# Altium schematic sheet R7FA4M3AF3CFB.SchDoc
size A3; SheetNumber: 9; SheetTotal: 13
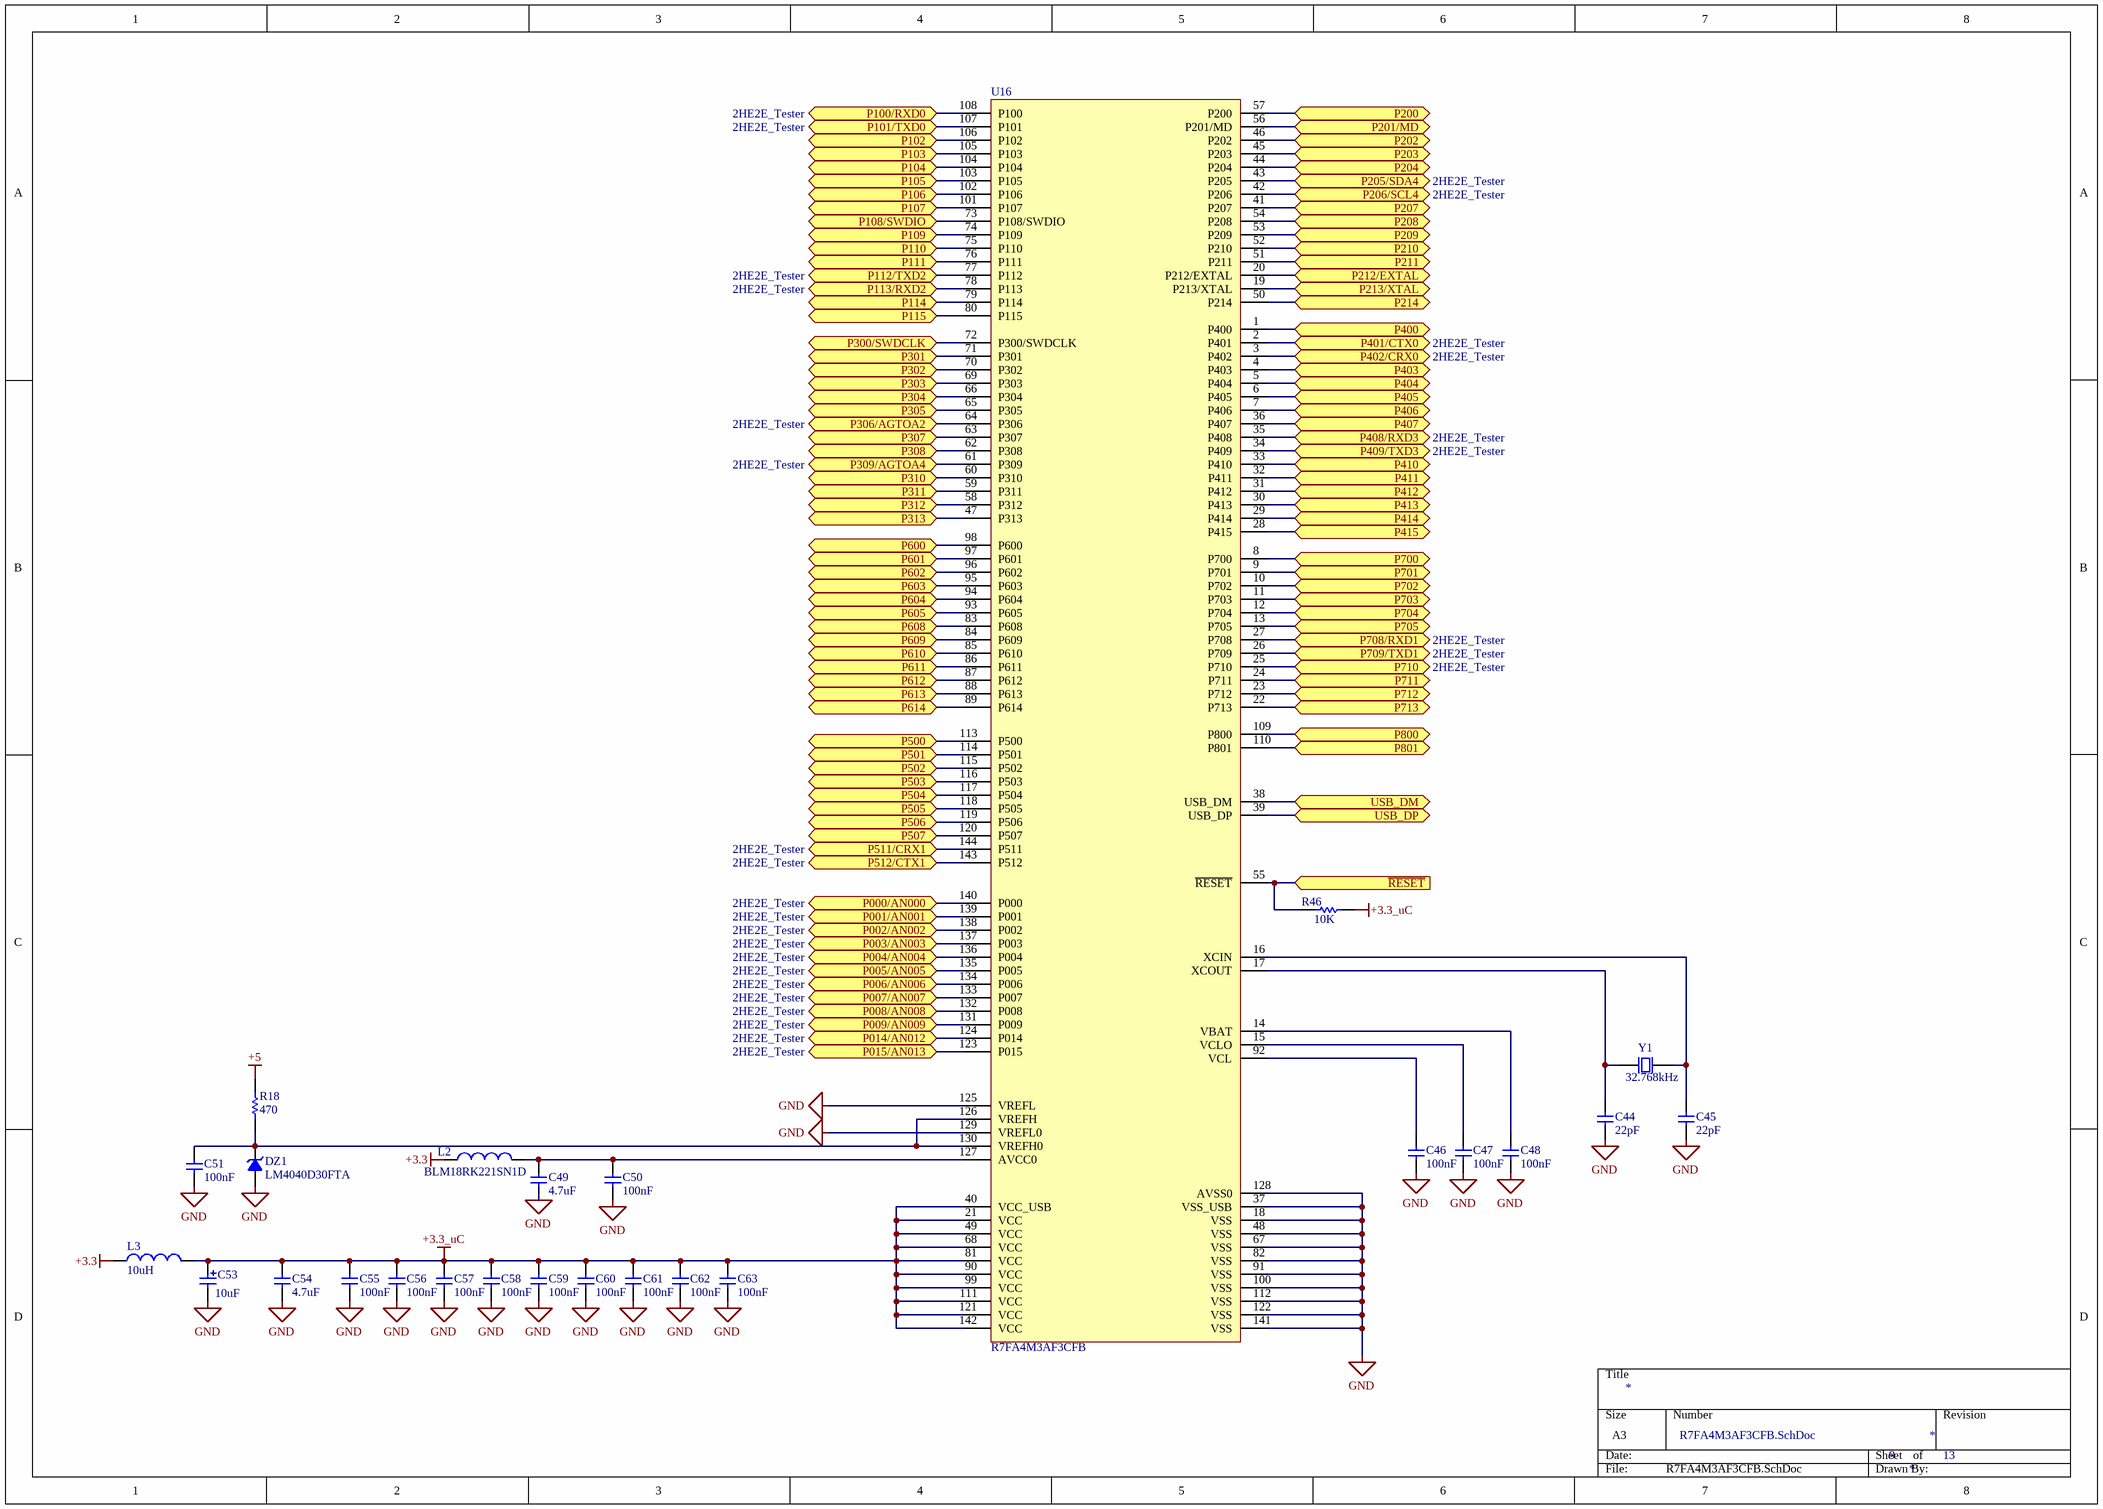
[diagram p0: R7FA4M3AF3CFB.SchDoc]

## Parts
C44  value 22pF  [0603M-C]  (hidden comment: Cap Ceramic)
C45  value 22pF  [0603M-C]  (hidden comment: Cap Ceramic)
C46  value 100nF  [0603M-C]  (hidden comment: Cap Ceramic)
C47  value 100nF  [0603M-C]  (hidden comment: Cap Ceramic)
C48  value 100nF  [0603M-C]  (hidden comment: Cap Ceramic)
C49  value 4.7uF  [0603M-C]  (hidden comment: Cap Ceramic)
C50  value 100nF  [0603M-C]  (hidden comment: Cap Ceramic)
C51  value 100nF  [0603M-C]  (hidden comment: Cap Ceramic)
C53  value 10uF  [Cap CASE A]  (hidden comment: Cap Tantalio)
C54  value 4.7uF  [0603M-C]  (hidden comment: Cap Ceramic)
C55  value 100nF  [0603M-C]  (hidden comment: Cap Ceramic)
C56  value 100nF  [0603M-C]  (hidden comment: Cap Ceramic)
C57  value 100nF  [0603M-C]  (hidden comment: Cap Ceramic)
C58  value 100nF  [0603M-C]  (hidden comment: Cap Ceramic)
C59  value 100nF  [0603M-C]  (hidden comment: Cap Ceramic)
C60  value 100nF  [0603M-C]  (hidden comment: Cap Ceramic)
C61  value 100nF  [0603M-C]  (hidden comment: Cap Ceramic)
C62  value 100nF  [0603M-C]  (hidden comment: Cap Ceramic)
C63  value 100nF  [0603M-C]  (hidden comment: Cap Ceramic)
DZ1  LM4040D30FTA  [SOT23 ZR4040]
L2  BLM18RK221SN1D  [0603M]
L3  value 10uH  [1210ML]  (hidden comment: Induttanza)
R18  value 470  [0603M]  (hidden comment: Resistor)
R46  value 10K  [0603M]  (hidden comment: Resistor)
U16  R7FA4M3AF3CFB  [TQFP50P2200X2200X170-144N]
Y1  32.768kHz  [WE-XTAL_CFPX-217]

## Ports
P000/AN000 (bidir, see 2HE2E_Tester), P001/AN001 (bidir, see 2HE2E_Tester), P002/AN002 (bidir, see 2HE2E_Tester), P003/AN003 (bidir, see 2HE2E_Tester), P004/AN004 (bidir, see 2HE2E_Tester), P005/AN005 (bidir, see 2HE2E_Tester), P006/AN006 (bidir, see 2HE2E_Tester), P007/AN007 (bidir, see 2HE2E_Tester), P008/AN008 (bidir, see 2HE2E_Tester), P009/AN009 (bidir, see 2HE2E_Tester), P014/AN012 (bidir, see 2HE2E_Tester), P015/AN013 (bidir, see 2HE2E_Tester), P100/RXD0 (bidir, see 2HE2E_Tester), P101/TXD0 (bidir, see 2HE2E_Tester), P102 (bidir, see 2HE2E_Tester), P103 (bidir, see 2HE2E_Tester), P104 (bidir, see 2HE2E_Tester), P105 (bidir, see 2HE2E_Tester), P106 (bidir, see 2HE2E_Tester), P107 (bidir, see 2HE2E_Tester), P108/SWDIO (bidir, see 2HE2E_Tester), P109 (bidir, see 2HE2E_Tester), P110 (bidir, see 2HE2E_Tester), P111 (bidir, see 2HE2E_Tester), P112/TXD2 (bidir, see 2HE2E_Tester), P113/RXD2 (bidir, see 2HE2E_Tester), P114 (bidir, see 2HE2E_Tester), P115 (bidir, see 2HE2E_Tester), P200 (bidir, see 2HE2E_Tester), P201/MD (bidir, see 2HE2E_Tester), P202 (bidir, see 2HE2E_Tester), P203 (bidir, see 2HE2E_Tester), P204 (bidir, see 2HE2E_Tester), P205/SDA4 (bidir, see 2HE2E_Tester), P206/SCL4 (bidir, see 2HE2E_Tester), P207 (bidir, see 2HE2E_Tester), P208 (bidir, see 2HE2E_Tester), P209 (bidir, see 2HE2E_Tester), P210 (bidir, see 2HE2E_Tester), P211 (bidir, see 2HE2E_Tester), P212/EXTAL (bidir, see 2HE2E_Tester), P213/XTAL (bidir, see 2HE2E_Tester), P214 (bidir, see 2HE2E_Tester), P300/SWDCLK (bidir, see 2HE2E_Tester), P301 (bidir, see 2HE2E_Tester), P302 (bidir, see 2HE2E_Tester), P303 (bidir, see 2HE2E_Tester), P304 (bidir, see 2HE2E_Tester), P305 (bidir, see 2HE2E_Tester), P306/AGTOA2 (bidir, see 2HE2E_Tester), P307 (bidir, see 2HE2E_Tester), P308 (bidir, see 2HE2E_Tester), P309/AGTOA4 (bidir, see 2HE2E_Tester), P310 (bidir, see 2HE2E_Tester), P311 (bidir, see 2HE2E_Tester), P312 (bidir, see 2HE2E_Tester), P313 (bidir, see 2HE2E_Tester), P400 (bidir, see 2HE2E_Tester), P401/CTX0 (bidir, see 2HE2E_Tester), P402/CRX0 (bidir, see 2HE2E_Tester), P403 (bidir, see 2HE2E_Tester), P404 (bidir, see 2HE2E_Tester), P405 (bidir, see 2HE2E_Tester), P406 (bidir, see 2HE2E_Tester), P407 (bidir, see 2HE2E_Tester), P408/RXD3 (bidir, see 2HE2E_Tester), P409/TXD3 (bidir, see 2HE2E_Tester), P410 (bidir, see 2HE2E_Tester), P411 (bidir, see 2HE2E_Tester), P412 (bidir, see 2HE2E_Tester), P413 (bidir, see 2HE2E_Tester), P414 (bidir, see 2HE2E_Tester), P415 (bidir, see 2HE2E_Tester), P500 (bidir, see 2HE2E_Tester), P501 (bidir, see 2HE2E_Tester), P502 (bidir, see 2HE2E_Tester), P503 (bidir, see 2HE2E_Tester), P504 (bidir, see 2HE2E_Tester), P505 (bidir, see 2HE2E_Tester), P506 (bidir, see 2HE2E_Tester), P507 (bidir, see 2HE2E_Tester), P511/CRX1 (bidir, see 2HE2E_Tester), P512/CTX1 (bidir, see 2HE2E_Tester), P600 (bidir, see 2HE2E_Tester), P601 (bidir, see 2HE2E_Tester), P602 (bidir, see 2HE2E_Tester), P603 (bidir, see 2HE2E_Tester), P604 (bidir, see 2HE2E_Tester), P605 (bidir, see 2HE2E_Tester), P608 (bidir, see 2HE2E_Tester), P609 (bidir, see 2HE2E_Tester), P610 (bidir, see 2HE2E_Tester), P611 (bidir, see 2HE2E_Tester), P612 (bidir, see 2HE2E_Tester), P613 (bidir, see 2HE2E_Tester), P614 (bidir, see 2HE2E_Tester), P700 (bidir, see 2HE2E_Tester), P701 (bidir, see 2HE2E_Tester), P702 (bidir, see 2HE2E_Tester), P703 (bidir, see 2HE2E_Tester), P704 (bidir, see 2HE2E_Tester), P705 (bidir, see 2HE2E_Tester), P708/RXD1 (bidir, see 2HE2E_Tester), P709/TXD1 (bidir, see 2HE2E_Tester), P710 (bidir, see 2HE2E_Tester), P711 (bidir, see 2HE2E_Tester), P712 (bidir, see 2HE2E_Tester), P713 (bidir, see 2HE2E_Tester), P800 (bidir, see 2HE2E_Tester), P801 (bidir, see 2HE2E_Tester), USB_DM (bidir, see 2HE2E_Tester), USB_DP (bidir, see 2HE2E_Tester), ~{RESET} (in, see 2HE2E_Tester)

## Nets
+3.3: L2.1 L3.1
+3.3_uC: C53.1 C54.2 C55.2 C56.2 C57.2 C58.2 C59.2 C60.2 C61.2 C62.2 C63.2 L3.2 R46.1 U16.21(VCC) U16.40(VCC_USB) U16.49(VCC) U16.68(VCC) U16.81(VCC) U16.90(VCC) U16.99(VCC) U16.111(VCC) U16.121(VCC) U16.142(VCC)
+5: R18.2
GND: C44.1 C45.1 C46.1 C47.1 C48.1 C49.1 C50.1 C51.1 C53.2 C54.1 C55.1 C56.1 C57.1 C58.1 C59.1 C60.1 C61.1 C62.1 C63.1 DZ1.1(A) U16.18(VSS) U16.37(VSS_USB) U16.48(VSS) U16.67(VSS) U16.82(VSS) U16.91(VSS) U16.100(VSS) U16.112(VSS) U16.122(VSS) U16.125(VREFL) U16.128(AVSS0) U16.129(VREFL0) U16.141(VSS)
P000/AN000: U16.140(P000) ; port P000/AN000
P001/AN001: U16.139(P001) ; port P001/AN001
P002/AN002: U16.138(P002) ; port P002/AN002
P003/AN003: U16.137(P003) ; port P003/AN003
P004/AN004: U16.136(P004) ; port P004/AN004
P005/AN005: U16.135(P005) ; port P005/AN005
P006/AN006: U16.134(P006) ; port P006/AN006
P007/AN007: U16.133(P007) ; port P007/AN007
P008/AN008: U16.132(P008) ; port P008/AN008
P009/AN009: U16.131(P009) ; port P009/AN009
P014/AN012: U16.124(P014) ; port P014/AN012
P015/AN013: U16.123(P015) ; port P015/AN013
P100/RXD0: U16.108(P100) ; port P100/RXD0
P101/TXD0: U16.107(P101) ; port P101/TXD0
P102: U16.106(P102) ; port P102
P103: U16.105(P103) ; port P103
P104: U16.104(P104) ; port P104
P105: U16.103(P105) ; port P105
P106: U16.102(P106) ; port P106
P107: U16.101(P107) ; port P107
P108/SWDIO: U16.73(P108/SWDIO) ; port P108/SWDIO
P109: U16.74(P109) ; port P109
P110: U16.75(P110) ; port P110
P111: U16.76(P111) ; port P111
P112/TXD2: U16.77(P112) ; port P112/TXD2
P113/RXD2: U16.78(P113) ; port P113/RXD2
P114: U16.79(P114) ; port P114
P115: U16.80(P115) ; port P115
P200: U16.57(P200) ; port P200
P201/MD: U16.56(P201/MD) ; port P201/MD
P202: U16.46(P202) ; port P202
P203: U16.45(P203) ; port P203
P204: U16.44(P204) ; port P204
P205/SDA4: U16.43(P205) ; port P205/SDA4
P206/SCL4: U16.42(P206) ; port P206/SCL4
P207: U16.41(P207) ; port P207
P208: U16.54(P208) ; port P208
P209: U16.53(P209) ; port P209
P210: U16.52(P210) ; port P210
P211: U16.51(P211) ; port P211
P212/EXTAL: U16.20(P212/EXTAL) ; port P212/EXTAL
P213/XTAL: U16.19(P213/XTAL) ; port P213/XTAL
P214: U16.50(P214) ; port P214
P300/SWDCLK: U16.72(P300/SWDCLK) ; port P300/SWDCLK
P301: U16.71(P301) ; port P301
P302: U16.70(P302) ; port P302
P303: U16.69(P303) ; port P303
P304: U16.66(P304) ; port P304
P305: U16.65(P305) ; port P305
P306/AGTOA2: U16.64(P306) ; port P306/AGTOA2
P307: U16.63(P307) ; port P307
P308: U16.62(P308) ; port P308
P309/AGTOA4: U16.61(P309) ; port P309/AGTOA4
P310: U16.60(P310) ; port P310
P311: U16.59(P311) ; port P311
P312: U16.58(P312) ; port P312
P313: U16.47(P313) ; port P313
P400: U16.1(P400) ; port P400
P401/CTX0: U16.2(P401) ; port P401/CTX0
P402/CRX0: U16.3(P402) ; port P402/CRX0
P403: U16.4(P403) ; port P403
P404: U16.5(P404) ; port P404
P405: U16.6(P405) ; port P405
P406: U16.7(P406) ; port P406
P407: U16.36(P407) ; port P407
P408/RXD3: U16.35(P408) ; port P408/RXD3
P409/TXD3: U16.34(P409) ; port P409/TXD3
P410: U16.33(P410) ; port P410
P411: U16.32(P411) ; port P411
P412: U16.31(P412) ; port P412
P413: U16.30(P413) ; port P413
P414: U16.29(P414) ; port P414
P415: U16.28(P415) ; port P415
P500: U16.113(P500) ; port P500
P501: U16.114(P501) ; port P501
P502: U16.115(P502) ; port P502
P503: U16.116(P503) ; port P503
P504: U16.117(P504) ; port P504
P505: U16.118(P505) ; port P505
P506: U16.119(P506) ; port P506
P507: U16.120(P507) ; port P507
P511/CRX1: U16.144(P511) ; port P511/CRX1
P512/CTX1: U16.143(P512) ; port P512/CTX1
P600: U16.98(P600) ; port P600
P601: U16.97(P601) ; port P601
P602: U16.96(P602) ; port P602
P603: U16.95(P603) ; port P603
P604: U16.94(P604) ; port P604
P605: U16.93(P605) ; port P605
P608: U16.83(P608) ; port P608
P609: U16.84(P609) ; port P609
P610: U16.85(P610) ; port P610
P611: U16.86(P611) ; port P611
P612: U16.87(P612) ; port P612
P613: U16.88(P613) ; port P613
P614: U16.89(P614) ; port P614
P700: U16.8(P700) ; port P700
P701: U16.9(P701) ; port P701
P702: U16.10(P702) ; port P702
P703: U16.11(P703) ; port P703
P704: U16.12(P704) ; port P704
P705: U16.13(P705) ; port P705
P708/RXD1: U16.27(P708) ; port P708/RXD1
P709/TXD1: U16.26(P709) ; port P709/TXD1
P710: U16.25(P710) ; port P710
P711: U16.24(P711) ; port P711
P712: U16.23(P712) ; port P712
P713: U16.22(P713) ; port P713
P800: U16.109(P800) ; port P800
P801: U16.110(P801) ; port P801
~{RESET}: R46.2 U16.55(~{RESET}) ; port ~{RESET}
USB_DM: U16.38(USB_DM) ; port USB_DM
USB_DP: U16.39(USB_DP) ; port USB_DP
NetC44_2: C44.2 U16.17(XCOUT) Y1.2
NetC45_2: C45.2 U16.16(XCIN) Y1.1
NetC46_2: C46.2 U16.92(VCL)
NetC47_2: C47.2 U16.15(VCLO)
NetC48_2: C48.2 U16.14(VBAT)
NetC49_2: C49.2 C50.2 L2.2 U16.127(AVCC0)
NetC51_2: C51.2 DZ1.2(K) R18.1 U16.126(VREFH) U16.130(VREFH0)

## Notes on the sheet
- Title
- Size:
- Date:
- A4
- Number:
- Time:
- Revision:
- Sheet
- of
- File:

## Library data of the parts
C44 C45 = Cap Ceramic: Ceramic Capacitor
C46-C48 C50 C51 C55-C63 = Cap Ceramic: Ceramic Capacitor 25V
C49 C54 = Cap Ceramic: Ceramic Capacitor 6.3V
C53 = Cap Tantalio: Capacitor tantalio 10V
DZ1 = Diodo Zener: Reference 3V
L2 = Induttanza: Ferrite Bead; Value: 220@100MHz
L3 = Induttanza: WE 744032100
U16 = R7FA4M3Ax3CFB: RA4M3 100 MHz Arm Cortex-M33 core 144 pin
Y1 = Quarzo: WE-XTAL  830108488401- Watch Crystals  32.768kHz ±20ppm 12.5pF